# EAGLE design TIMB-E010-2 (EAGLE 6.2)
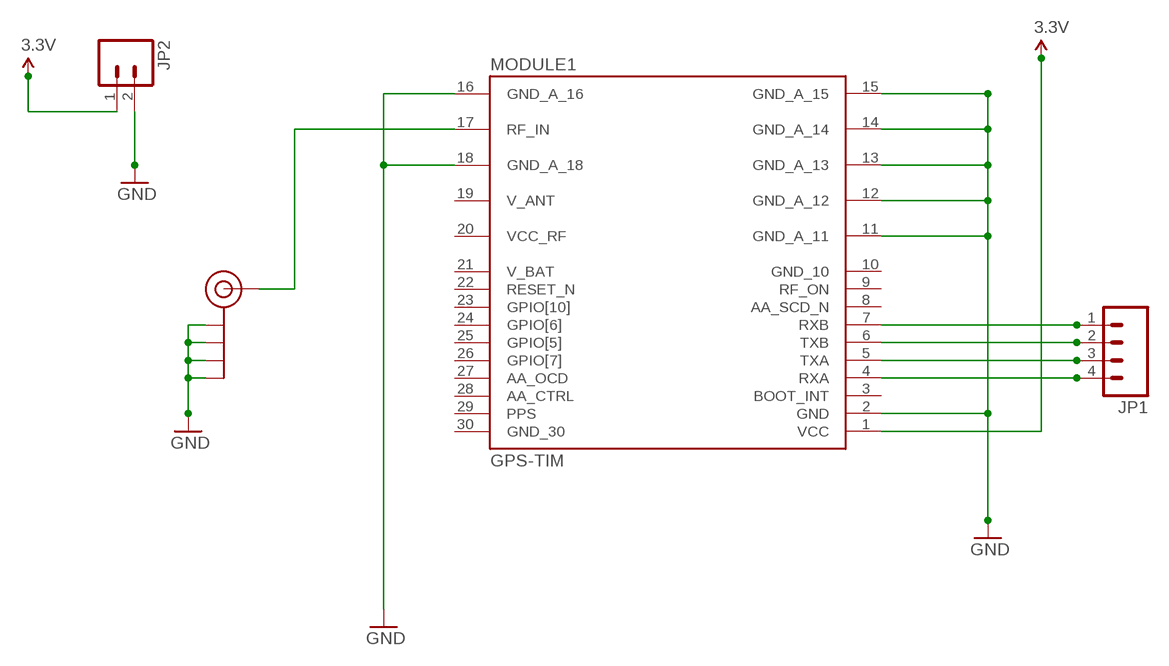
[diagram p0: schematic, sheet 1]

## Parts
J$1  SMA_EDGE  [SMA-EDGE]
JP1  M04LOCK  [1X04_LOCK]
JP2  M02LOCK  [1X02_LOCK]
MODULE1  GPS-TIM  [GPS_TIM]

## Nets
3.3V: JP2.1 MODULE1.1(VCC)
GND: J$1.GND@0(GND) J$1.GND@1(GND) J$1.GND@2(GND) J$1.GND@3(GND) JP2.2 MODULE1.2(GND) MODULE1.11(GND_A_11) MODULE1.12(GND_A_12) MODULE1.13(GND_A_13) MODULE1.14(GND_A_14) MODULE1.15(GND_A_15) MODULE1.16(GND_A_16) MODULE1.18(GND_A_18)
N$1: J$1.SIG(SIGNAL) MODULE1.17(RF_IN)
N$3: JP1.3 MODULE1.5(TXA)
N$4: JP1.4 MODULE1.4(RXA)
N$5: JP1.1 MODULE1.7(RXB)
N$6: JP1.2 MODULE1.6(TXB)
Unconnected: MODULE1.3(BOOT_INT) MODULE1.8(AA_SCD_N) MODULE1.9(RF_ON) MODULE1.10(GND_10) MODULE1.19(V_ANT) MODULE1.20(VCC_RF) MODULE1.21(V_BAT) MODULE1.22(RESET_N) MODULE1.23(GPIO[10]) MODULE1.24(GPIO[6]) MODULE1.25(GPIO[5]) MODULE1.26(GPIO[7]) MODULE1.27(AA_OCD) MODULE1.28(AA_CTRL) MODULE1.29(PPS) MODULE1.30(GND_30)

## Library data of the parts
J$1 = SparkFun-Connectors:SMA_EDGE: SMA Antenna Connector End launch SMA connector. The paste layer has been removed so that the connector can be hand soldered onto the board after reflow.
JP1 = SparkFun-Connectors:M04: Header 4 Standard 4-pin 0.1" header. Use with straight break away headers (SKU : PRT-00116), right angle break away headers (PRT-00553), swiss pins (PRT-00743), machine pins (PRT-00117), and female headers (PRT-00115). Molex polarized connector foot print use with SKU : PRT-08231 with associated crimp pins and housings. 1MM SMD Version SKU: PRT-10208
JP2 = SparkFun-Connectors:M02: Header 2 Standard 2-pin 0.1" header. Use with straight break away headers (SKU : PRT-00116), right angle break away headers (PRT-00553), swiss pins (PRT-00743), machine pins (PRT-00117), and female headers (PRT-00115). Molex polarized connector foot print use with SKU : PRT-08233 with associated crimp pins and housings.
MODULE1 = ublox TIMB:GPS-TIM: GPS macro component © u-blox ag, 1997-2003 http://www.u-blox.com

## Board
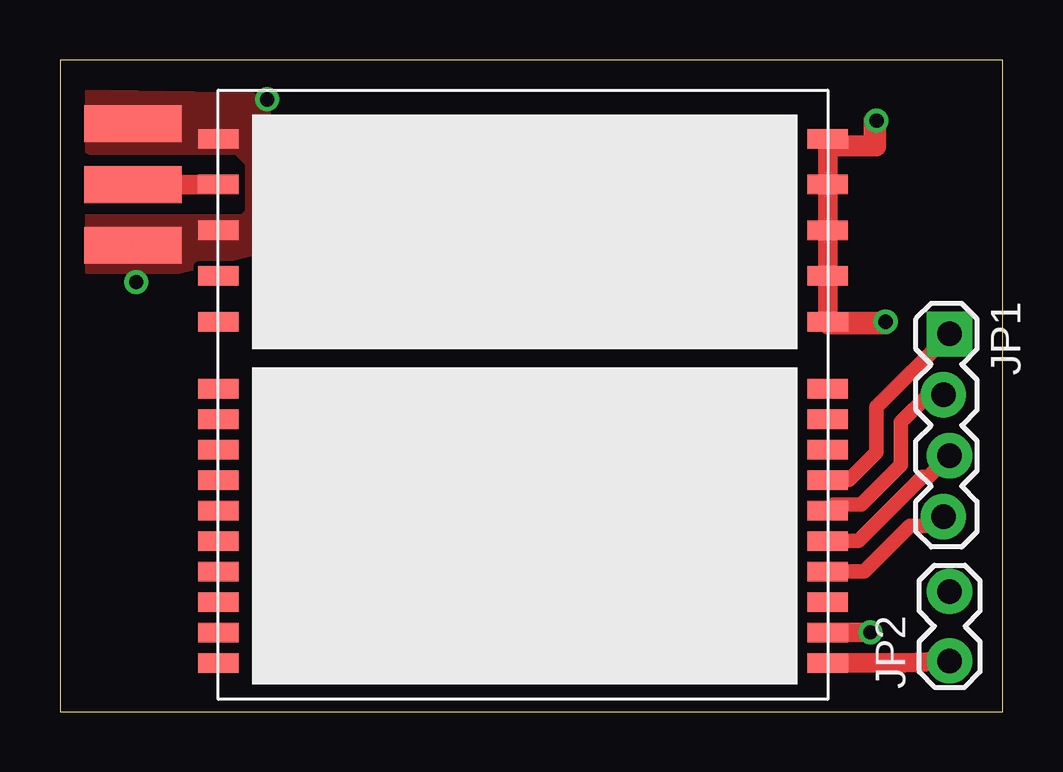
[diagram p1: board, top side]
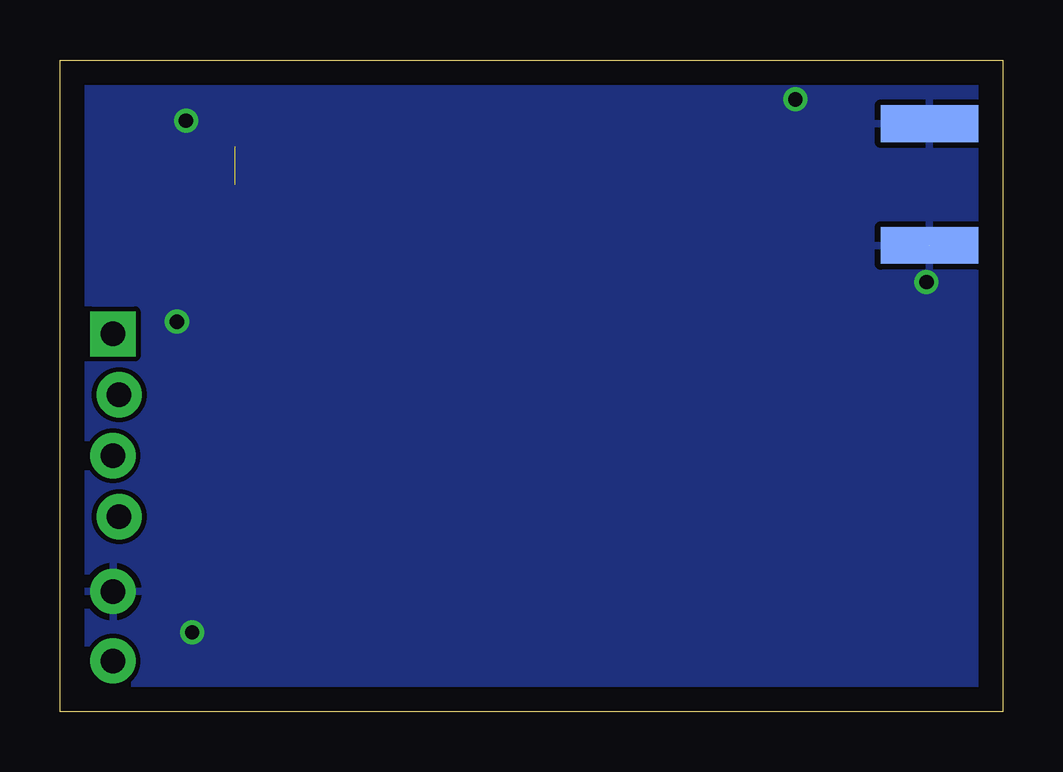
[diagram p2: board, bottom side, seen from below]

Size 39.29 x 27.17 mm. Coordinates in mm from the lower left corner, seen from the top.
Outline: 0,0 39.29,0 39.29,27.17 0,27.17 0,0
Copper layers (1*16): Top 0.035mm / dielectric 1.5mm / Bottom 0.035mm
Design rules: minimum track width 10mil, minimum drill 24mil, track to track 8mil, track to pad 8mil, pad to pad 8mil, via to via 8mil, smd to smd 8mil, copper to edge 40mil, drill to drill 8mil, minimum pad ring 10mil, minimum via ring 8mil, stop-mask expansion 4mil, vias tented up to drill 0mil, thermal gap 10mil

### Footprints (pad centres in the part's own frame; a part is rotated, then mirrored left to right if it is on the bottom)
SMA-EDGE = smd 1.524 x 4.064: GND@0 0,0; GND@1 5.08,0; SIG 2.54,0 | smd 1.524 x 4.064 bottom: GND@2 0,0; GND@3 5.08,0
1X04_LOCK = drill 1.016 pad 1.88 square: 1 0,0.127 | drill 1.016 pad 1.88: 2 2.54,-0.127; 3 5.08,0.127; 4 7.62,-0.127
1X02_LOCK = drill 1.016 pad 1.88: 1 -0.178,0; 2 2.718,0
GPS_TIM = smd 1.676 x 0.813: 1 12.7,-11.176; 2 12.7,-9.906; 3 12.7,-8.636; 4 12.7,-7.366; 5 12.7,-6.096; 6 12.7,-4.826; 7 12.7,-3.556; 8 12.7,-2.286; 9 12.7,-1.016; 10 12.7,0.254; 11 12.7,3.048; 12 12.7,4.953; 13 12.7,6.858; 14 12.7,8.763; 15 12.7,10.668; 16 -12.7,10.668; 17 -12.7,8.763; 18 -12.7,6.858; 19 -12.7,4.953; 20 -12.7,3.048; 21 -12.7,0.254; 22 -12.7,-1.016; 23 -12.7,-2.286; 24 -12.7,-3.556; 25 -12.7,-4.826; 26 -12.7,-6.096; 27 -12.7,-7.366; 28 -12.7,-8.636; 29 -12.7,-9.906; 30 -12.7,-11.176

### Placement (x,y rotation side)
J$1  3.05,24.51 270 top
JP1  36.96,15.75 270 top
JP2  37.08,2.29 90 top
MODULE1  19.3,13.21 0 top

### Tracks (layer width: path | path; a pad name or v marks a point on that pad's centre or on a via)
3.3V
  Top 0.813: MODULE1.1 35.18,2.03 JP2.1
GND  (via drill 0.6)  (2 unrouted)
  Top 0.813: MODULE1.12 MODULE1.11 v34.42,16.26 34.42,16.13 32,16.13 MODULE1.12 | 32,23.62 MODULE1.15 | 32,23.55 34.04,23.55 v34.04,24.64 33.91,24.64 33.91,23.62 32,23.62 | 32,23.62 32,23.55 | 32,23.55 MODULE1.13 MODULE1.12 | MODULE1.2 v33.78,3.3
  other vias: 8.64,25.53 3.17,17.91
  pour Top (no thermals): 8,25.65 0.89,25.78 0.63,25.4 0.63,23.75 1.27,23.37 7.37,23.37 7.87,22.86 7.87,20.83 7.62,20.57 1.02,20.57 0.63,20.19 0.63,18.8 1.14,18.41 4.95,18.41 8.13,19.18 8.64,19.68 8.64,25.02
  pour Bottom: 0.76,27.05 38.73,27.05 38.73,0.38 0.63,0.38
N$1
  Top 0.813: J$1.SIG MODULE1.17
N$3
  Top 0.61: MODULE1.5 33.27,7.11 35.94,9.78 36.2,9.78 JP1.3
N$4
  Top 0.61: MODULE1.4 33.53,5.84 35.43,7.75 36.45,7.75 JP1.4
N$5
  Top 0.61: MODULE1.7 32.89,9.65 34.04,10.79 34.04,12.7 JP1.1
N$6
  Top 0.61: JP1.2 36.2,13.21 35.05,12.06 35.05,10.29 33.4,8.64 32.26,8.64 MODULE1.6